# Altium schematic sheet ESP12E.SchDoc
size A4
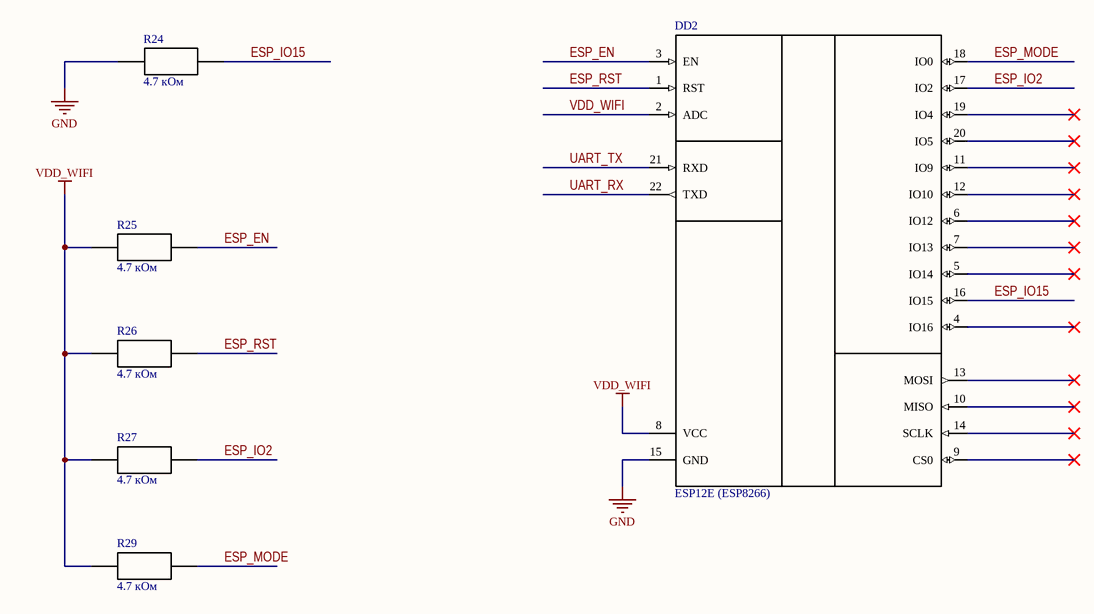
[diagram p0: ESP12E.SchDoc]

## Parts
DD2  ESP12E (ESP8266)  [ESP-12E]
R24  4.7 кОм  [RES 0805]
R25  4.7 кОм  [RES 0805]
R26  4.7 кОм  [RES 0805]
R27  4.7 кОм  [RES 0805]
R29  4.7 кОм  [RES 0805]

## Nets
GND: DD2.15(GND) R24.2
VDD_WIFI: DD2.2(ADC) DD2.8(VCC) R25.2 R26.2 R27.2 R29.2
ESP_EN: DD2.3(EN) R25.1
ESP_IO2: DD2.17(IO2) R27.1
ESP_IO15: DD2.16(IO15) R24.1
ESP_MODE: DD2.18(IO0) R29.1
ESP_RST: DD2.1(RST) R26.1
UART_RX: DD2.22(TXD)
UART_TX: DD2.21(RXD)

Not connected (* = marked no-connect by the designer): DD2 4(IO16)* 5(IO14)* 6(IO12)* 7(IO13)* 9(CS0)* 10(MISO)* 11(IO9)* 12(IO10)* 13(MOSI)* 14(SCLK)* 19(IO4)* 20(IO5)*

## Library data of the parts
R24-R27 R29 = RES 0805